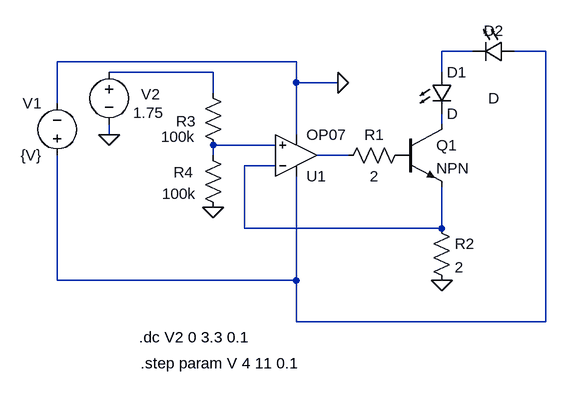
[diagram p0: schematic IR-Led-Constant_Current.asc]
IR-Led-Constant_Current.asc, the LTspice schematic file:
Version 4
SHEET 1 880 680
WIRE 432 -48 384 -48
WIRE 544 -48 496 -48
WIRE 160 -32 -208 -32
WIRE 32 -16 -128 -16
WIRE 384 -16 384 -48
WIRE 160 0 160 -32
WIRE 224 0 160 0
WIRE 32 16 32 -16
WIRE -208 32 -208 -32
WIRE 384 64 384 48
WIRE -128 80 -128 64
WIRE 160 80 160 0
WIRE 128 96 32 96
WIRE 32 112 32 96
WIRE 240 112 192 112
WIRE 128 128 80 128
WIRE 80 224 80 128
WIRE 384 224 384 160
WIRE 384 224 80 224
WIRE -208 304 -208 112
WIRE 160 304 160 144
WIRE 160 304 -208 304
WIRE 160 368 160 304
WIRE 544 368 544 -48
WIRE 544 368 160 368
FLAG -128 80 0
FLAG 224 0 0
FLAG 384 304 0
FLAG 32 192 0
SYMBOL voltage -128 -32 R0
WINDOW 0 49 50 Left 2
WINDOW 3 37 78 Left 2
WINDOW 123 0 0 Left 0
WINDOW 39 0 0 Left 0
SYMATTR InstName V2
SYMATTR Value 1.75
SYMBOL voltage -208 128 R180
WINDOW 0 24 96 Left 2
WINDOW 3 24 16 Left 2
WINDOW 123 0 0 Left 0
WINDOW 39 0 0 Left 0
SYMATTR InstName V1
SYMATTR Value {V}
SYMBOL OpAmps\\OP07 160 176 M180
SYMATTR InstName U1
SYMBOL res 336 96 R90
WINDOW 0 0 56 VBottom 2
WINDOW 3 32 56 VTop 2
SYMATTR InstName R1
SYMATTR Value 2
SYMBOL npn 320 64 R0
SYMATTR InstName Q1
SYMBOL res 368 208 R0
SYMATTR InstName R2
SYMATTR Value 2
SYMBOL LED 368 -16 R0
SYMATTR InstName D1
SYMBOL res 16 0 R0
WINDOW 0 -41 59 Left 2
WINDOW 3 -64 83 Left 2
SYMATTR InstName R3
SYMATTR Value 100k
SYMBOL res 16 96 R0
WINDOW 0 -45 42 Left 2
WINDOW 3 -63 75 Left 2
SYMATTR InstName R4
SYMATTR Value 100k
SYMBOL LED 496 -64 R90
WINDOW 0 0 32 VBottom 2
WINDOW 3 72 32 VTop 2
SYMATTR InstName D2
TEXT -82 392 Left 2 !.dc V2 0 3.3 0.1
TEXT -80 432 Left 2 !.step param V 4 11 0.1

The netlist it stands for:
* IR-Led-Constant_Current.asc
V2 N003 0 1.75
V1 N002 0 {V}
XU1 N005 N007 N002 0 N006 LT1001  ; OP07, pins In+ In- V+ V- OUT
R1 P001 N006 2
Q1 N004 P001 N007 0 NPN
R2 N007 0 2
D1 N001 N004 D
R3 N003 N005 100k
R4 N005 0 100k
D2 N002 N001 D
.model D D
.lib standard.dio
.model NPN NPN
.model PNP PNP
.lib standard.bjt
.dc V2 0 3.3 0.1
.step param V 4 11 0.1
.lib LTC.lib
.backanno
.end